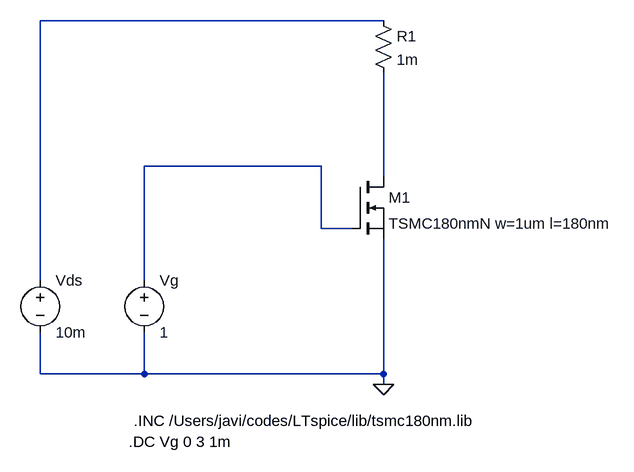
[diagram p0: schematic nmos.asc]
nmos.asc, the LTspice schematic file:
Version 4
SHEET 1 1216 808
WIRE 336 112 -192 112
WIRE 240 336 -32 336
WIRE 336 352 336 192
WIRE 240 432 240 336
WIRE 288 432 240 432
WIRE -192 512 -192 112
WIRE -32 512 -32 336
WIRE -192 656 -192 592
WIRE -32 656 -32 592
WIRE -32 656 -192 656
WIRE 336 656 336 448
WIRE 336 656 -32 656
WIRE 336 672 336 656
FLAG 336 672 0
SYMBOL voltage -192 496 R0
SYMATTR InstName Vds
SYMATTR Value 10m
SYMBOL voltage -32 496 R0
SYMATTR InstName Vg
SYMATTR Value 1
SYMBOL nmos 288 352 R0
SYMATTR InstName M1
SYMATTR Value TSMC180nmN w=1um l=180nm
SYMBOL res 320 96 R0
SYMATTR InstName R1
SYMATTR Value 1m
TEXT -48 728 Left 2 !.INC /Users/javi/codes/LTspice/lib/tsmc180nm.lib
TEXT -56 760 Left 2 !.DC Vg 0 3 1m

The netlist it stands for:
* nmos.asc
Vds N001 0 10m
Vg N002 0 1
M1 N003 N002 0 0 TSMC180nmN w=1um l=180nm
R1 N001 N003 1m
.model NMOS NMOS
.model PMOS PMOS
.lib standard.mos
.INC /Users/javi/codes/LTspice/lib/tsmc180nm.lib
.DC Vg 0 3 1m
.backanno
.end